# Altium schematic sheet LAN.SchDoc
size A4
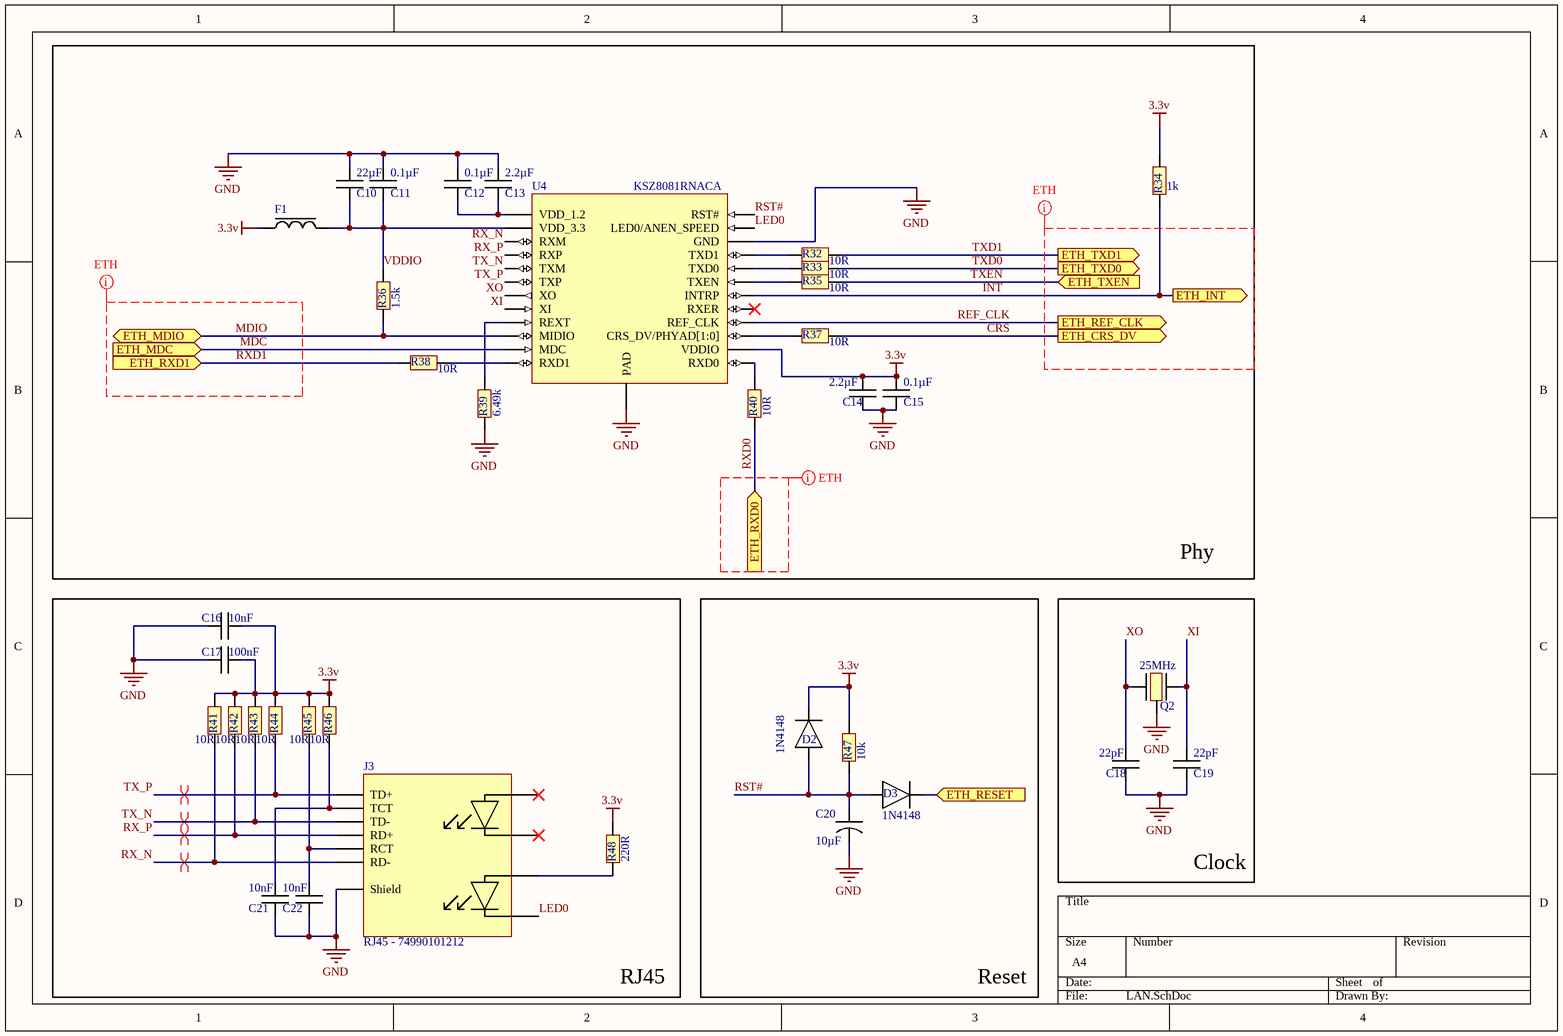
[diagram p0: LAN.SchDoc]

## Parts
C10  22µF  [0603]
C11  0.1µF  [0603]
C12  0.1µF  [0603]
C13  2.2µF  [0603]
C14  2.2µF  [0603]
C15  0.1µF  [0603]
C16  10nF  [0603]
C17  100nF  [0603]
C18  22pF  [0603]
C19  22pF  [0603]
C20  10µF  [Capa_Radial_D4mm_H5.5mm]
C21  10nF  [0603]
C22  10nF  [0603]
D2  1N4148  [SOD123]
D3  1N4148  [SOD123]
F1  Ferrite  [0805_W1.25]  (value not drawn)
J3  RJ45 - 74990101212  [RJ45]
Q2  25MHz  [SMD_3225]
R32  10R  [0603]
R33  10R  [0603]
R34  1k  [0603]
R35  10R  [0603]
R36  1.5k  [0603]
R37  10R  [0603]
R38  10R  [0603]
R39  6.49k  [0603]
R40  10R  [0603]
R41  10R  [0603]
R42  10R  [0603]
R43  10R  [0603]
R44  10R  [0603]
R45  10R  [0603]
R46  10R  [0603]
R47  10k  [0603]
R48  220R  [0603]
U4  KSZ8081RNACA  [QFN50P400X400X90_HS-25M]

## Blocks framed on the sheet
Phy: C10-C15 F1 R32-R40 U4
RJ45: C16 C17 C21 C22 J3 R41-R46 R48
Reset: C20 D2 D3 R47
Clock: C18 C19 Q2

## Ports
ETH_CRS_DV (out), ETH_INT (out), ETH_MDC (in), ETH_MDIO (bidir), ETH_REF_CLK (out), ETH_RESET (in), ETH_RXD0 (in), ETH_RXD1 (in), ETH_TXD0 (out), ETH_TXD1 (out), ETH_TXEN (in)

## Nets
3.3v: C14.2 C15.2 C16.2 C17.2 D2.2 F1.1 R34.1 R41.2 R42.2 R43.2 R44.2 R45.2 R46.2 R47.2 R48.2 U4.14(VDDIO)
GND: C10.2 C11.2 C12.2 C13.2 C14.1 C15.1 C16.1 C17.1 C18.1 C19.1 C20.2 C21.1 C22.1 J3.8(Shield) Q2.3 R39.1 U4.22(GND) U4.25(PAD)
CRS: R37.1 ; port ETH_CRS_DV
ETH_RESET: D3.2 ; port ETH_RESET
INT: R34.2 U4.18(INTRP) ; port ETH_INT
LED0: J3.11 U4.23(LED0/ANEN_SPEED)
MDC: U4.11(MDC) ; port ETH_MDC
MDIO: R36.1 U4.10(MIDIO) ; port ETH_MDIO
REF_CLK: U4.16(REF_CLK) ; port ETH_REF_CLK
RST#: C20.1 D2.1 D3.1 R47.1 U4.24(RST#)
RX_N: J3.6(RD-) R41.1 U4.3(RXM)
RX_P: J3.4(RD+) R42.1 U4.4(RXP)
RXD0: R40.2 ; port ETH_RXD0
RXD1: R38.1 ; port ETH_RXD1
TX_N: J3.3(TD-) R43.1 U4.5(TXM)
TX_P: J3.1(TD+) R44.1 U4.6(TXP)
TXD0: R33.1 ; port ETH_TXD0
TXD1: R32.1 ; port ETH_TXD1
TXEN: R35.1 ; port ETH_TXEN
VDDIO: C10.1 C11.1 F1.2 R36.2 U4.2(VDD_3.3)
XI: C19.2 Q2.2 U4.8(XI)
XO: C18.2 Q2.1 U4.7(XO)
NetC12_1: C12.1 C13.1 U4.1(VDD_1.2)
NetC21_2: C21.2 J3.2(TCT) R46.1
NetC22_2: C22.2 J3.5(RCT) R45.1
NetJ3_12: J3.12 R48.1
NetR32_2: R32.2 U4.21(TXD1)
NetR33_2: R33.2 U4.20(TXD0)
NetR35_2: R35.2 U4.19(TXEN)
NetR37_2: R37.2 U4.15(CRS_DV/PHYAD[1:0])
NetR38_2: R38.2 U4.12(RXD1)
NetR39_2: R39.2 U4.9(REXT)
NetR40_1: R40.1 U4.13(RXD0)

Not connected (* = marked no-connect by the designer): J3 9* 10(11)*; U4 17(RXER)*

## Layout directives
rule Matched Net Lengths [Tolerance = 2mm]; net class ETH: (no net found under the mark), MDC, MDIO, RXD1
differential pair; rule Differential Pairs Routing [Pref Gap = 0.3mm    Min Gap  = 0.2mm    Max Gap  = 0.4mmPref Width = 0.2mm    Min Width  = 0.1mm    Max Width  = 0.3mm]; net class ETH_DIFF: RX_N, RX_P, TX_N, TX_P

## Library data of the parts
C10-C19 C21 C22 = Capa
C20 = Capa_pola: Manufacturer 1: Wurth Electronics; Manufacturer Part Number 1: 865090240001; Voltage Rating: 10V; Polarity: Polar; Ripple Current: 23mA; Life (Hours): 1000Hour; Tolerance: 20%; Capacitance: 10uF; Supplier 1: Farnell; Supplier Part Number 1: 2466357; Stock 1: 126; Pricing 1: 1=0,23700, 5=0,23100, 10=0,20400, 20=0,16500, 40=0,16300, 100=0,11300, 500=0,08920 (EUR); RoHS: Yes; Mount: Surface Mount; Case/Package: Radial; Min Operating Temperature: -40°C; Max Operating Temperature: 85°C; Package Quantity: 2000; Packaging: Cut Tape; Ripple Current (AC): 23mA; Voltage Rating (DC): 10V; Diameter: 4mm; Height: 5.5mm; Height - Seated (Max): 0.217inch; REACH SVHC: Unknown; ComponentLink1URL: http://www.farnell.com/datasheets/1880200.pdf?src-supplier=Farnell; ComponentLink1Description: http://www.farnell.com/datasheets/1880200.pdf?src-supplier=Farnell; ComponentLink2URL: http://www.farnell.com/datasheets/1880200.pdf?src-supplier=Element14; ComponentLink2Description: http://www.farnell.com/datasheets/1880200.pdf?src-supplier=Element14; ComponentLink3URL: https://katalog.we-online.de/pbs/datasheet/865090240001.pdf?src-supplier=Digi-Key; ComponentLink3Description: https://katalog.we-online.de/pbs/datasheet/865090240001.pdf?src-supplier=Digi-Key; ComponentLink4URL: http://katalog.we-online.de/pbs/datasheet/865090240001.pdf?src-supplier=Digi-Key; ComponentLink4Description: http://katalog.we-online.de/pbs/datasheet/865090240001.pdf?src-supplier=Digi-Key
D2 D3 = 1N4148: Manufacturer 1: Diodes; Manufacturer Part Number 1: 1N4148W-7-F; Current Rating: 150mA; Voltage: 100V; Current: 15A; Max Surge Current: 2A; Peak Reverse Current: 1uA; Recovery Time: 4ns; Forward Voltage: 1.25V; Average Rectified Current: 300mA; Power Dissipation: 400mW; Element Configuration: Single; Polarity: Standard; Voltage Rating (DC): 75V; Capacitance: 2pF; Supplier 1: Farnell; Stock 1: 844343; Pricing 1: 5=0,16300, 25=0,15900, 100=0,05530, 250=0,05220, 500=0,04810, 1000=0,02600, 5000=0,01940 (EUR); RoHS: Yes; Mount: Surface Mount; Number of Pins: 2; Weight: 0.000353oz; Contact Plating: Tin,Matte; Min Operating Temperature: -65°C; Max Operating Temperature: 150°C; Package Quantity: 3000; Packaging: Tape and Reel; Forward Current: 150mA; Reverse Recovery Time: 4ns; Max Repetitive Reverse Voltage (Vrrm): 100V; Max Forward Surge Current (Ifsm): 2A; Peak Non-Repetitive Surge Current: 2A; Power Rating: 400mW; Output Current: 150mA; Max Reverse Voltage (DC): 100V; Length: 2.85mm; Height: 1.25mm; Width: 1.7mm; Radiation Hardening: No; Lead Free: Lead Free; REACH SVHC: No SVHC; ComponentLink1URL: https://datasheet.ciiva.com/22695/1915529-22695239.pdf?src-supplier=Element14; ComponentLink1Description: https://datasheet.ciiva.com/22695/1915529-22695239.pdf?src-supplier=Element14; ComponentLink2URL: https://datasheet.ciiva.com/911/ds30086-911736.pdf?src-supplier=Digi-Key; ComponentLink2Description: https://datasheet.ciiva.com/911/ds30086-911736.pdf?src-supplier=Digi-Key; ComponentLink3URL: https://datasheet.ciiva.com/1179/1915529-1179304.pdf?src-supplier=Element14; ComponentLink3Description: https://datasheet.ciiva.com/1179/1915529-1179304.pdf?src-supplier=Element14; ComponentLink4URL: https://datasheet.ciiva.com/25919/ds30086-25919609.pdf?src-supplier=Avnet+Europe; ComponentLink4Description: https://datasheet.ciiva.com/25919/ds30086-25919609.pdf?src-supplier=Avnet+Europe; ComponentLink5URL: https://datasheet.ciiva.com/15219/getdatasheetpartid-110030-15219548.pdf?src-supplier=Verical; ComponentLink5Description: https://datasheet.ciiva.com/15219/getdatasheetpartid-110030-15219548.pdf?src-supplier=Verical; ComponentLink6URL: https://datasheet.ciiva.com/911/ds30086-911734.pdf?src-supplier=Digi-Key; ComponentLink6Description: https://datasheet.ciiva.com/911/ds30086-911734.pdf?src-supplier=Digi-Key; ComponentLink7URL: https://datasheet.ciiva.com/911/ds30086-911735.pdf?src-supplier=Digi-Key; ComponentLink7Description: https://datasheet.ciiva.com/911/ds30086-911735.pdf?src-supplier=Digi-Key; ComponentLink8URL: https://datasheet.ciiva.com/4435/ds30086-4435128.pdf?src-supplier=Mouser; ComponentLink8Description: https://datasheet.ciiva.com/4435/ds30086-4435128.pdf?src-supplier=Mouser; ComponentLink9URL: https://datasheet.ciiva.com/8300/ds30086-8300392.pdf?src-supplier=Avnet; ComponentLink9Description: https://datasheet.ciiva.com/8300/ds30086-8300392.pdf?src-supplier=Avnet; ComponentLink10URL: https://datasheet.ciiva.com/8303/ds30086-8303197.pdf?src-supplier=Avnet; ComponentLink10Description: https://datasheet.ciiva.com/8303/ds30086-8303197.pdf?src-supplier=Avnet; Supplier Part Number 1: 1776392
F1 = Ferrite: Manufacturer 1: Murata; Manufacturer Part Number 1: BLM21PG121SN1D; Material: Steel,Ferrite; Impedance: 120R; Current Rating: 3A; DC Resistance (DCR): 30mR; Number of Lines: 1; Tolerance: 25%; Test Frequency: 100MHz; Supplier 1: Farnell; Stock 1: 13249; Pricing 1: 10=0,06150, 100=0,03810, 500=0,02760, 1000=0,02500, 2000=0,02050, 4000=0,01820, 20000=0,01430 (EUR); RoHS: Yes; Case/Package: 0805; Number of Pins: 2; Case Code (Metric): 2012; Case Code (Imperial): 0805; Min Operating Temperature: -55°C; Max Operating Temperature: 125°C; Packaging: Tape and Reel; Number of Circuits: 1; Package Quantity: 1; Max Current Rating: 3A; Max DC Current: 3A; Termination: SMD/SMT; Length: 2mm; Height: 0.85mm; Width: 1.25mm; Depth: 1.25mm; REACH SVHC: No SVHC; Lead Free: Lead Free; ComponentLink1URL: https://datasheet.ciiva.com/16420/l0110s0100blm21p-16420725.pdf?src-supplier=Future+Electronics; ComponentLink1Description: https://datasheet.ciiva.com/16420/l0110s0100blm21p-16420725.pdf?src-supplier=Future+Electronics; ComponentLink2URL: https://datasheet.ciiva.com/6211/l0110s0100blm21p-6211734.pdf?src-supplier=Digi-Key; ComponentLink2Description: https://datasheet.ciiva.com/6211/l0110s0100blm21p-6211734.pdf?src-supplier=Digi-Key; ComponentLink3URL: https://datasheet.ciiva.com/6211/l0110s0100blm21p-6211738.pdf?src-supplier=Digi-Key; ComponentLink3Description: https://datasheet.ciiva.com/6211/l0110s0100blm21p-6211738.pdf?src-supplier=Digi-Key; ComponentLink4URL: https://datasheet.ciiva.com/6211/l0110s0100blm21p-6211739.pdf?src-supplier=Digi-Key; ComponentLink4Description: https://datasheet.ciiva.com/6211/l0110s0100blm21p-6211739.pdf?src-supplier=Digi-Key; ComponentLink5URL: https://datasheet.ciiva.com/46423/1756152-46423915.pdf?src-supplier=Element14; ComponentLink5Description: https://datasheet.ciiva.com/46423/1756152-46423915.pdf?src-supplier=Element14; Supplier Part Number 1: 2443252
J3 = RJ45: Manufacturer 1: Wurth Electronics; Supplier 1: Mouser; Manufacturer Part Number 1: 74990101212; Stock 1: 68; Pricing 1: 1=6,59000, 10=6,21000, 25=5,99000, 50=5,88000, 100=5,76000, 250=5,48000, 500=5,19000, 1000=4,91000, 2500=4,51000 (USD); RoHS: No; ComponentLink1URL: http://www.farnell.com/datasheets/2277299.pdf?src-supplier=Farnell; ComponentLink1Description: http://www.farnell.com/datasheets/2277299.pdf?src-supplier=Farnell; ComponentLink2URL: https://katalog.we-online.de/pbs/datasheet/74990101212.pdf?src-supplier=Digi-Key; ComponentLink2Description: https://katalog.we-online.de/pbs/datasheet/74990101212.pdf?src-supplier=Digi-Key; ComponentLink3URL: http://www.farnell.com/datasheets/2277299.pdf?src-supplier=Newark; ComponentLink3Description: http://www.farnell.com/datasheets/2277299.pdf?src-supplier=Newark; Supplier Part Number 1: 710-74990101212
Q2 = Quartz_25MHz: Manufacturer 1: Multicomp; Manufacturer Part Number 1: MCSJK-7U-25.00-12-10-60-B-10; Supplier 1: Farnell; Stock 1: 529; Pricing 1: 5=0,16400, 50=0,13300, 250=0,12300, 500=0,11500, 1500=0,11100, 3000=0,10000, 15000=0,09850 (EUR); RoHS: No; ComponentLink1URL: http://www.farnell.com/datasheets/2645227.pdf?src-supplier=Farnell; ComponentLink1Description: http://www.farnell.com/datasheets/2645227.pdf?src-supplier=Farnell; Supplier Part Number 1: 2853968
R32-R48 = Resistance
U4 = KSZ8081RNACA: IC TXRX ETHERNET 24QFN; Manufacturer 1: Microchip; Simplex/Duplex: Full Duplex; Supplier 1: Farnell; Manufacturer Part Number 1: KSZ8081RNACA; Stock 1: 869; Pricing 1: 1=0,89100, 25=0,82400, 100=0,75700 (EUR); RoHS: Yes; Mount: Surface Mount; Case/Package: QFN; Min Operating Temperature: 0°C; Max Operating Temperature: 70°C; Packaging: Rail/Tube; ComponentLink1URL: http://www.farnell.com/datasheets/2310338.pdf?src-supplier=Farnell; ComponentLink1Description: http://www.farnell.com/datasheets/2310338.pdf?src-supplier=Farnell; ComponentLink2URL: http://www.microchip.com/mymicrochip/filehandler.aspx?ddocname=en581592&src-supplier=Digi-Key; ComponentLink2Description: http://www.microchip.com/mymicrochip/filehandler.aspx?ddocname=en581592&src-supplier=Digi-Key; Supplier Part Number 1: 2809920